# EAGLE design untitled (EAGLE 9.1.3)
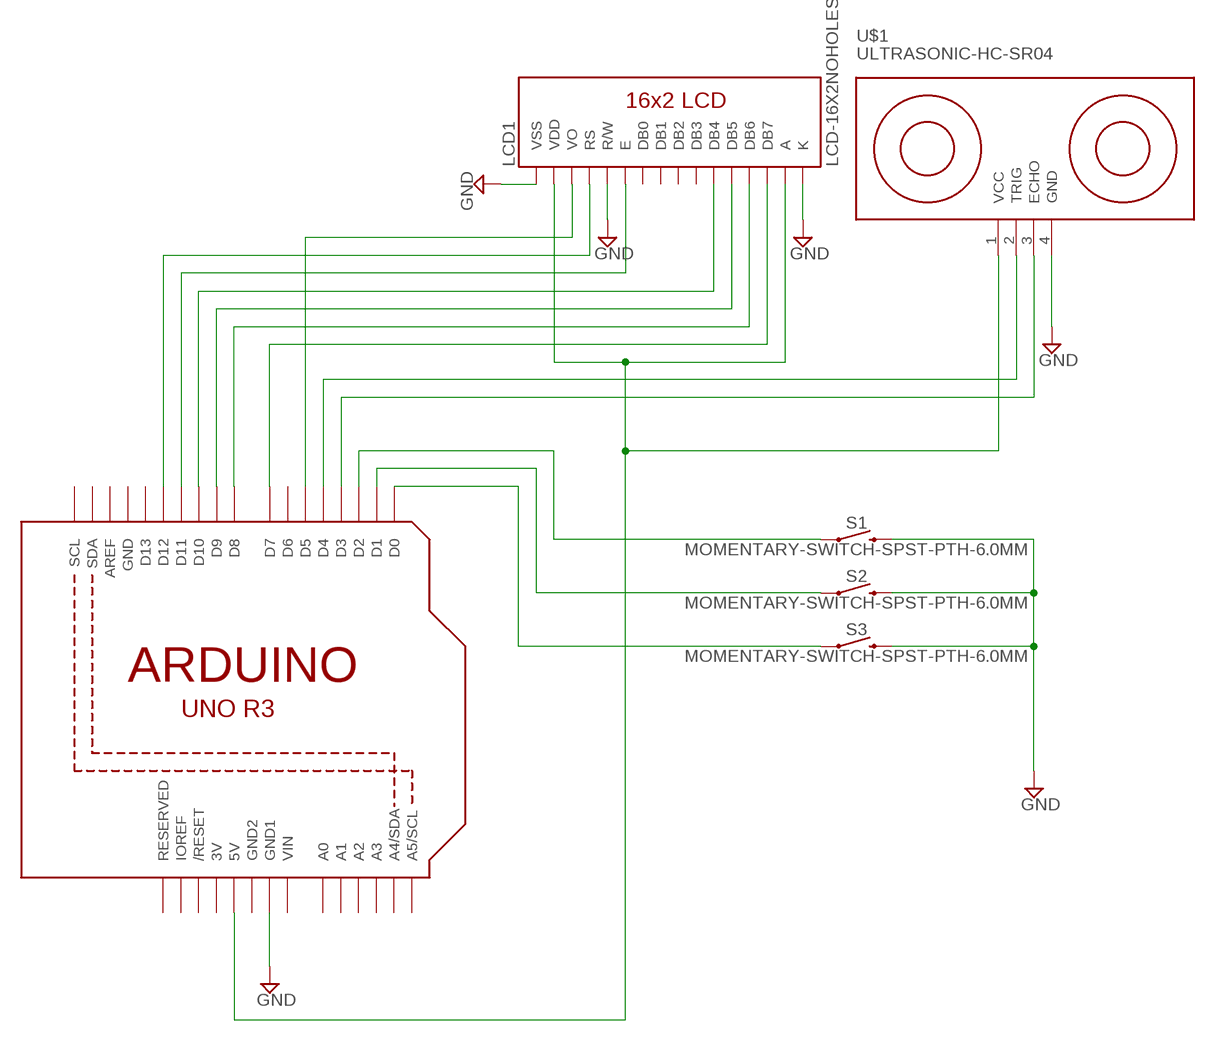
[diagram p0: schematic, sheet 1]

## Parts
LCD1  LCD-16X2NOHOLES  [LCD-16X2_NOHOLESNOSILK]
S1  MOMENTARY-SWITCH-SPST-PTH-6.0MM  [TACTILE_SWITCH_PTH_6.0MM]
S2  MOMENTARY-SWITCH-SPST-PTH-6.0MM  [TACTILE_SWITCH_PTH_6.0MM]
S3  MOMENTARY-SWITCH-SPST-PTH-6.0MM  [TACTILE_SWITCH_PTH_6.0MM]
U1  ARDUINOR3-BPLACE  [ARDUINOR3-BPLACE]
U$1  ULTRASONIC-HC-SR04  [ULTRASONIC-HC-SR04]

## Nets
GND: LCD1.1(VSS) LCD1.5(R/W) LCD1.16(K) S1.3 S2.3 S3.3 U1.GND1 U$1.4(GND)
N$1: LCD1.6(E) U1.D11
N$2: LCD1.4(RS) U1.D12
N$3: LCD1.11(DB4) U1.D10
N$4: LCD1.12(DB5) U1.D9
N$5: LCD1.13(DB6) U1.D8
N$6: LCD1.14(DB7) U1.D7
N$7: LCD1.2(VDD) LCD1.15(A) U1.5V U$1.1(VCC)
N$8: LCD1.3(VO) U1.D5
N$9: U1.D3 U$1.3(ECHO)
N$10: U1.D4 U$1.2(TRIG)
N$12: S3.1 U1.D0
N$13: S2.1 U1.D1
N$14: S1.1 U1.D2
Unconnected: LCD1.7(DB0) LCD1.8(DB1) LCD1.9(DB2) LCD1.10(DB3) U1.A0 U1.A1 U1.A2 U1.A3 U1.A4(A4/SDA) U1.A5(A5/SCL) U1.AREF U1.D6 U1.D13 U1.IOREF U1.RESERVED U1.RESET(/RESET) U1.SCL U1.SDA

## Power pins joined to a net without a drawn wire
3V: U1.3V
GND: U1.GND
GND2: U1.GND2
VIN: U1.VIN

## Library data of the parts
LCD1 = SparkFun-Displays:LCD-16X2: Standard text-only 16x2 parallel input LCD Basic 16 character by 2 line display. Typically utilizes the extremely common HD44780 parallel interface chipset SparkFun Products: Basic 16x2 Green <https://www.sparkfun.com/products/255> Basic 8x2 Green <https://www.sparkfun.com/products/11122>; SF_ID: LCD-00255
S1-S3 = SparkFun-Switches:MOMENTARY-SWITCH-SPST: Momentary Switch (Pushbutton) - SPST Normally-open (NO) SPST momentary switches (buttons, pushbuttons). Variants PTH-12MM - 12mm square, through-hole Momentary Pushbutton Switch - 12mm Square <https://www.sparkfun.com/products/9190> (COM-09190) PTH-6.0MM, PTH-6.0MM-KIT - 6.0mm square, through-hole Mini Pushbutton Switch <https://www.sparkfun.com/products/97> (COM-00097) KIT package intended for soldering kit's - only one side of pads' copper is exposed. PTH-RIGHT-ANGLE-KIT - Right-angle, through-hole Right Angle Tactile Button <https://www.sparkfun.com/products/10791> - Used on SparkFun BigTime Watch Kit <https://www.sparkfun.com/products/11734> SMD-12MM - 12mm square, surface-mount Tactile Button - SMD (12mm) <https://www.sparkfun.com/products/12993> (COM-12993) Used on SparkFun PicoBoard <https://www.sparkfun.com/products/11888> SMD-4.5MM - 4.5mm Square Trackball Switch Used on SparkFun Blackberry Trackballer Breakout <https://www.sparkfun.com/products/13169> SMD-4.6MMX2.8MM - 4.60mm x 2.80mm, surface mount Used on SparkFun SAMD21 Mini Breakout <https://www.sparkfun.com/products/13664> SMD-5.2MM, SMD-5.2-REDUNDANT - 5.2mm square, surface-mount Mini Pushbutton Switch - SMD <https://www.sparkfun.com/products/8720> (COM-08720) Used on Arduino Pro Mini <https://www.sparkfun.com/products/11114> REDUNDANT package connects both switch circuits together SMD-6.0X3.5MM - 6.0 x 3.5mm, surface mount Momentary Reset Switch SMD <https://www.sparkfun.com/products/8229> (COM-08229) SMD-6.2MM-TALL - 6.2mm square, surface mount Tactile Button - SMD (6mm) <https://www.sparkfun.com/products/12992> Used on SparkFun Digital Sandbox <https://www.sparkfun.com/products/12651> SMD-RIGHT-ANGLE - Right-angle, surface mount Used on SparkFun Block for Intel® Edison - Arduino <https://www.sparkfun.com/products/13036>; PROD_ID: SWCH-08441; SF_SKU: COM-00097
U1 = adafruit:ARDUINOR3: This is a new object for the new Arduino R3 - with extra pins that you may want to use (such as IOref, and duplicated A4/A5
U$1 = diy-modules:ULTRASONIC-HC-SR04: Ultrasonic Ranging Module HC-SR04 More details available here: http://randomnerdtutorials.com/complete-guide-for-ultrasonic-sensor-hc-sr04/ Click here to find device on ebay.com <http://www.ebay.com/sch/hc+sr04+ultrasonic>

## Net classes
0 default: width 1 mm, drill 0.8 mm, clearance 0.4 mm

## Board
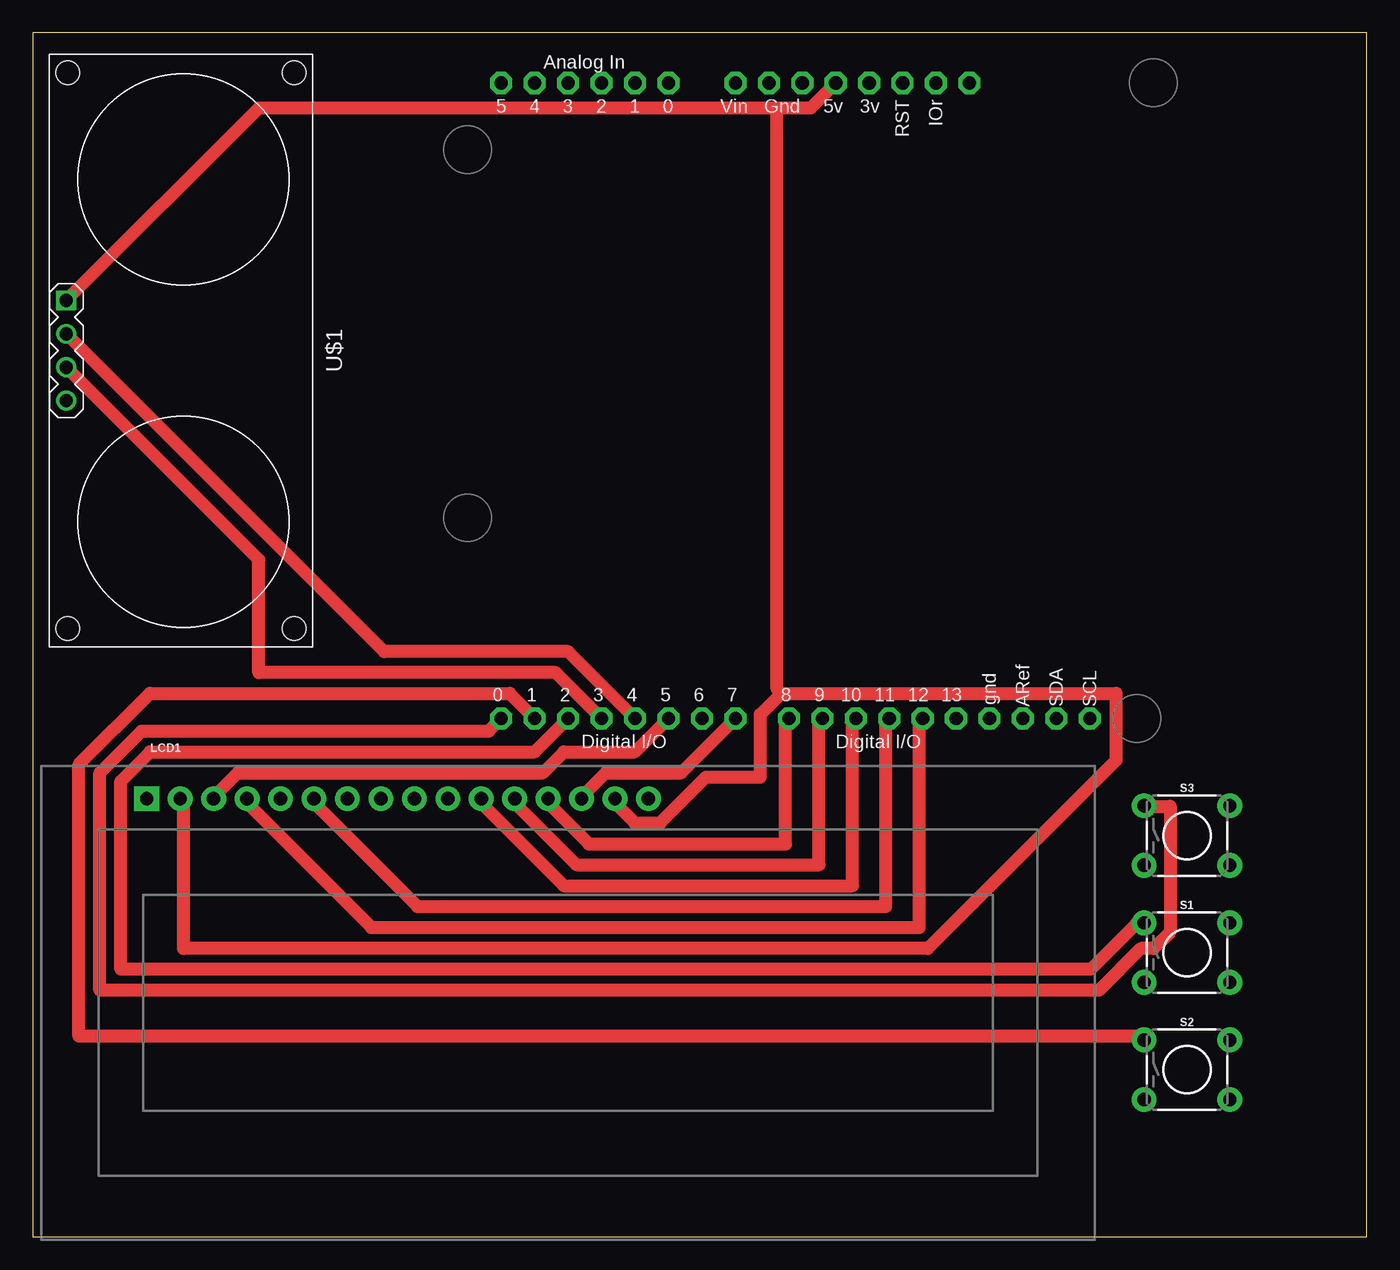
[diagram p1: board, top side]
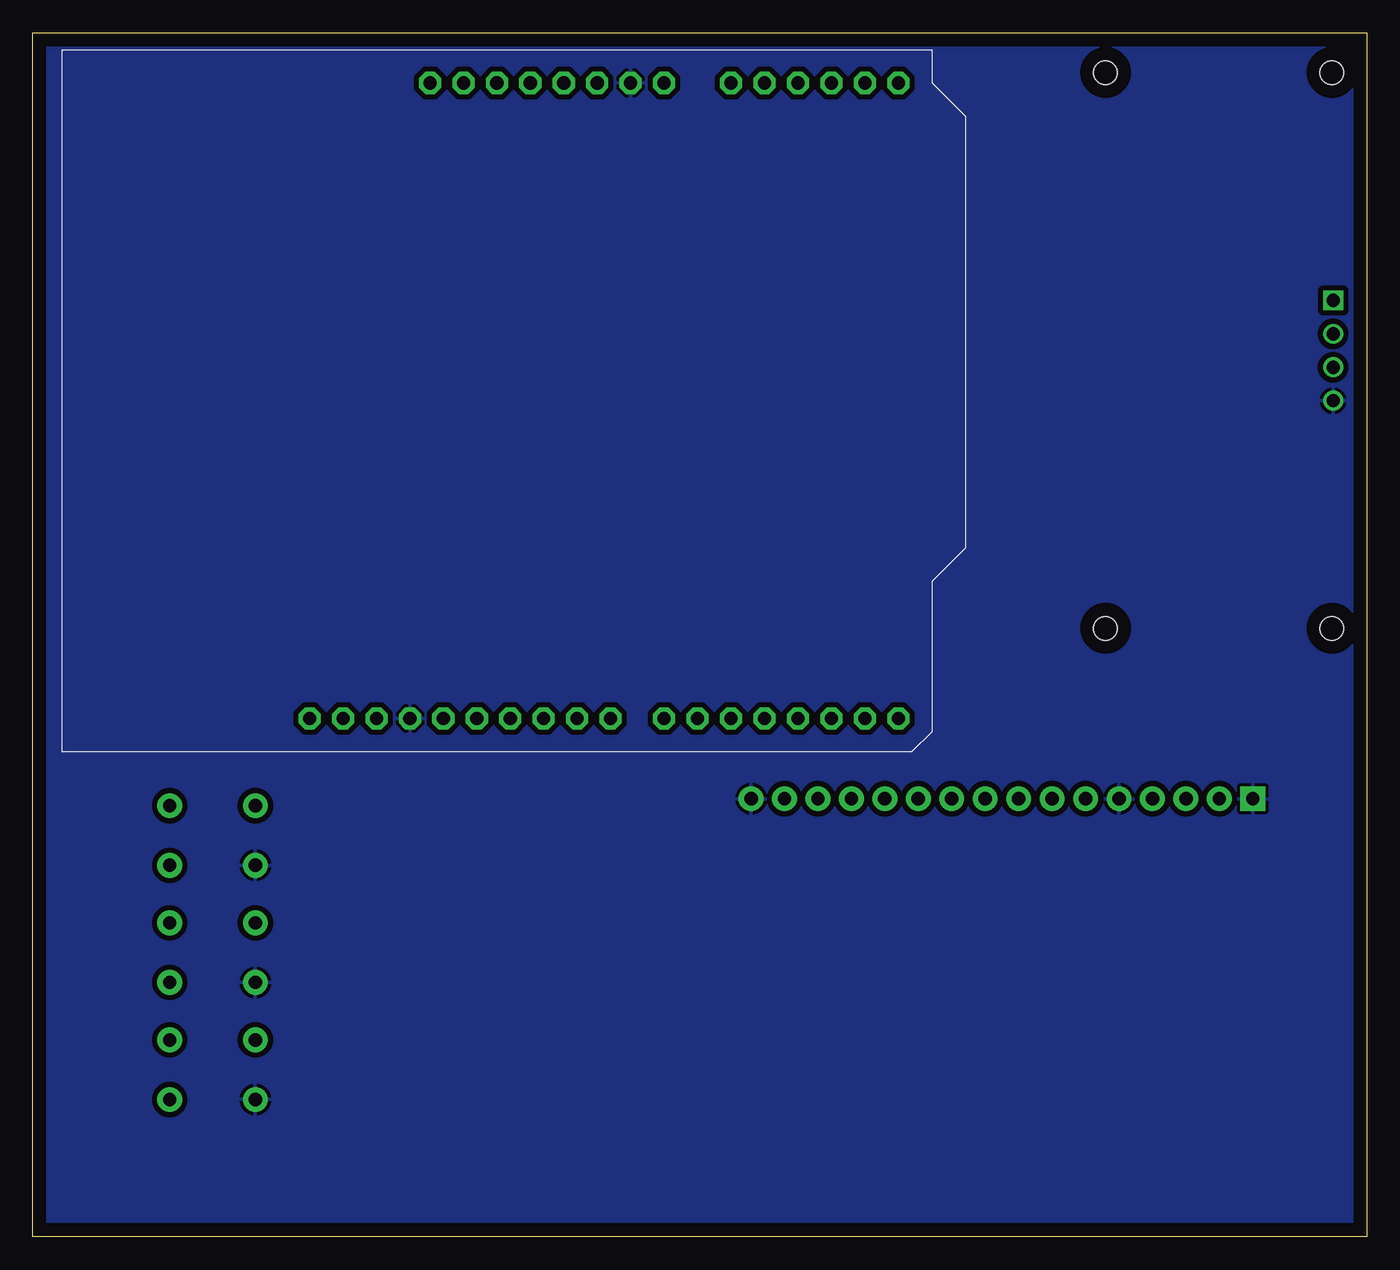
[diagram p2: board, bottom side, seen from below]

Size 101.27 x 91.43 mm. Coordinates in mm from the lower left corner, seen from the top.
Outline: 0,0 101.27,0 101.27,91.43 0,91.43 0,0
Copper layers (1*16): Top 0.035mm / dielectric 1.5mm / Bottom 0.035mm
Design rules "default": minimum track width 6mil, minimum drill 0.35mm, track to track 6mil, track to pad 6mil, pad to pad 6mil, via to via 6mil, smd to smd 6mil, copper to edge 40mil, drill to drill 6mil, minimum pad ring 10mil, minimum via ring 8mil, stop-mask expansion 4mil, vias tented up to drill 0mil, thermal gap 10mil

### Footprints (pad centres in the part's own frame; a part is rotated, then mirrored left to right if it is on the bottom)
LCD-16X2_NOHOLESNOSILK = drill 1.016 pad 1.88 square: 1 -32,15.5 | drill 1.016 pad 1.88: 2 -29.46,15.5; 3 -26.92,15.5; 4 -24.38,15.5; 5 -21.84,15.5; 6 -19.3,15.5; 7 -16.76,15.5; 8 -14.22,15.5; 9 -11.68,15.5; 10 -9.14,15.5; 11 -6.6,15.5; 12 -4.06,15.5; 13 -1.52,15.5; 14 1.02,15.5; 15 3.56,15.5; 16 6.1,15.5
TACTILE_SWITCH_PTH_6.0MM = drill 1.016 pad 1.88: 1 -3.251,2.261; 2 3.251,2.261; 3 -3.251,-2.261; 4 3.251,-2.261
ARDUINOR3-BPLACE = drill 1 pad 1.676 octagon: 3V 35.56,2.54; 5V 38.1,2.54; A0 50.8,2.54; A1 53.34,2.54; A2 55.88,2.54; A3 58.42,2.54; A4 60.96,2.54; A5 63.5,2.54; AREF 23.876,50.8; D0 63.5,50.8; D1 60.96,50.8; D2 58.42,50.8; D3 55.88,50.8; D4 53.34,50.8; D5 50.8,50.8; D6 48.26,50.8; D7 45.72,50.8; D8 41.656,50.8; D9 39.116,50.8; D10 36.576,50.8; D11 34.036,50.8; D12 31.496,50.8; D13 28.956,50.8; GND 26.416,50.8; GND1 43.18,2.54; GND2 40.64,2.54; IOREF 30.48,2.54; RESERVED 27.94,2.54; RESET 33.02,2.54; SCL 18.796,50.8; SDA 21.336,50.8; VIN 45.72,2.54
ULTRASONIC-HC-SR04 = drill 1 square: 1 -3.81,-8.89 | drill 1: 2 -1.27,-8.89; 3 1.27,-8.89; 4 3.81,-8.89 | hole 1.8: -21.1,8.4; -21.1,-8.8; 21.1,-8.8; 21.1,8.4

### Placement (x,y rotation side)
LCD1  40.64,17.78 0 top
S1  87.63,21.59 0 top
S2  87.63,12.7 0 top
S3  87.63,30.48 0 top
U1  99.06,90.17 180 top
U$1  11.43,67.31 270 top

### Tracks (layer width: path | path; a pad name or v marks a point on that pad's centre or on a via)
GND
  pour Bottom: 0,91.44 101.6,91.44 101.6,0 0,0
N$1
  Top 1: U1.D11 64.77,39.37 64.77,25.08 29.21,25.08 21.27,33.02 LCD1.6
N$2
  Top 1: U1.D12 67.31,39.37 67.31,23.5 25.72,23.5 16.19,33.02 LCD1.4
N$3
  Top 1: U1.D10 62.23,39.37 62.23,26.67 40.32,26.67 33.97,33.02 LCD1.11
N$4
  Top 1: U1.D9 59.69,39.37 59.69,28.26 41.27,28.26 36.51,33.02 LCD1.12
N$5
  Top 1: U1.D8 57.15,39.37 57.15,29.84 42.23,29.84 39.05,33.02 LCD1.13
N$6
  Top 1: U1.D7 49.21,35.24 43.5,35.24 41.59,33.34 LCD1.14
N$7
  Top 1: U$1.1 17.14,85.72 56.52,85.72 | 56.52,85.72 59.05,85.72 U1.5V | 56.83,41.27 82.23,41.27 82.23,36.2 67.94,21.91 11.43,21.91 11.43,33.02 LCD1.2 | 56.83,41.27 55.24,39.69 55.24,34.92 51.12,34.92 47.62,31.43 45.72,31.43 44.13,33.02 LCD1.15 | 56.52,85.72 56.52,85.41 56.52,41.59 56.83,41.27
N$8
  Top 1: U1.D5 45.72,36.83 40.32,36.83 38.73,35.24 15.56,35.24 13.65,33.34 LCD1.3
N$9
  Top 1: U$1.3 17.14,51.44 17.14,42.86 39.69,42.86 U1.D3
N$10
  Top 1: U$1.2 26.67,44.45 40.64,44.45 U1.D4
N$12
  Top 1: U1.D0 34.61,38.42 8.26,38.42 5.08,35.24 5.08,18.73 80.96,18.73 84.14,21.91 85.09,21.91 86.36,23.18 86.36,32.7 84.45,32.7 S3.1
N$13
  Top 1: U1.D1 36.2,41.27 8.89,41.27 3.49,35.88 3.49,15.24 84.14,15.24 S2.1
N$14
  Top 1: U1.D2 38.1,36.83 8.89,36.83 6.67,34.61 6.67,20.32 80.33,20.32 83.82,23.81 84.14,23.81 S1.1